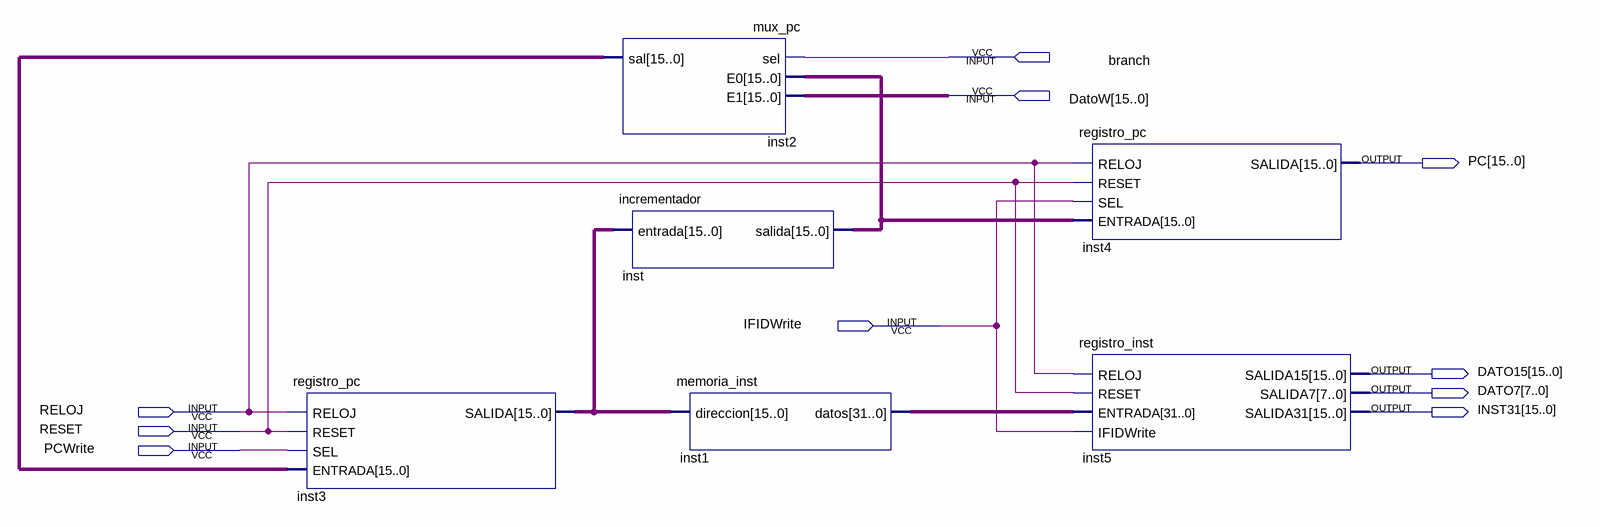
[diagram p0: schematic sheet]
// Quartus schematic etapa1.bdf as structural Verilog: 6 symbols, 10 pins
module etapa1 (
  input  branch,
  input  [15:0] DatoW,
  input  IFIDWrite,
  input  RELOJ,
  input  RESET,
  input  PCWrite,
  output [15:0] PC,
  output [15:0] DATO15,
  output [7:0] DATO7,
  output [15:0] INST31
);

  wire [15:0] inst2_sal, inst3_salida, inst_salida;
  wire [31:0] inst1_datos;

  registro_pc inst3 (.RELOJ(RELOJ), .RESET(RESET), .SEL(PCWrite), .ENTRADA(inst2_sal), .SALIDA(inst3_salida));
  mux_pc inst2 (.sel(branch), .E0(inst_salida), .E1(DatoW), .sal(inst2_sal));
  incrementador inst (.entrada(inst3_salida), .salida(inst_salida));
  memoria_inst inst1 (.direccion(inst3_salida), .datos(inst1_datos));
  registro_pc inst4 (.RELOJ(RELOJ), .RESET(RESET), .SEL(IFIDWrite), .ENTRADA(inst_salida), .SALIDA(PC));
  registro_inst inst5 (
    .RELOJ(RELOJ), .RESET(RESET), .ENTRADA(inst1_datos), .IFIDWrite(IFIDWrite), .SALIDA15(DATO15),
    .SALIDA7(DATO7), .SALIDA31(INST31));
endmodule
